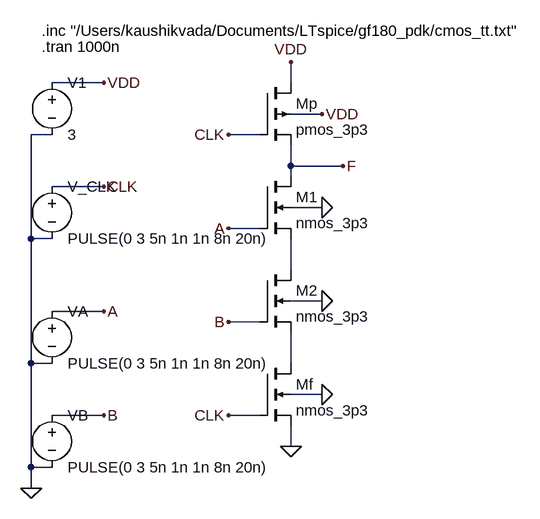
[diagram p0: schematic Q2_9.asc]
Q2_9.asc, the LTspice schematic file:
Version 4
SHEET 1 800 800
WIRE 80 48 160 48
WIRE 80 128 48 128
WIRE 48 128 48 288
WIRE 80 208 160 208
WIRE 80 288 48 288
WIRE 48 288 48 480
WIRE 80 400 160 400
WIRE 80 480 48 480
WIRE 48 480 48 640
WIRE 80 560 160 560
WIRE 80 640 48 640
WIRE 48 640 48 672
WIRE 448 48 448 16
WIRE 448 144 448 176
WIRE 448 176 448 192
WIRE 448 176 528 176
WIRE 448 288 448 336
WIRE 448 432 448 480
WIRE 448 576 448 608
WIRE 352 128 400 128
WIRE 352 272 400 272
WIRE 352 416 400 416
WIRE 352 560 400 560
WIRE 448 96 496 96
WIRE 448 240 496 240
WIRE 448 384 496 384
WIRE 448 528 496 528
FLAG 160 48 VDD
FLAG 48 672 0
FLAG 160 208 CLK
FLAG 160 400 A
FLAG 160 560 B
FLAG 448 16 VDD
FLAG 528 176 F
FLAG 352 128 CLK
FLAG 352 272 A
FLAG 352 416 B
FLAG 352 560 CLK
FLAG 496 96 VDD
FLAG 496 240 0
FLAG 496 384 0
FLAG 496 528 0
FLAG 448 608 0
SYMBOL voltage 80 32 R0
SYMATTR InstName V1
SYMATTR Value 3
SYMBOL voltage 80 192 R0
SYMATTR InstName V_CLK
SYMATTR Value PULSE(0 3 5n 1n 1n 8n 20n)
SYMBOL voltage 80 384 R0
SYMATTR InstName VA
SYMATTR Value PULSE(0 3 5n 1n 1n 8n 20n)
SYMBOL voltage 80 544 R0
SYMATTR InstName VB
SYMATTR Value PULSE(0 3 5n 1n 1n 8n 20n)
SYMBOL pmos4 400 48 R0
SYMATTR InstName Mp
SYMATTR Value pmos_3p3
SYMATTR SpiceLine W=1u L=1u
SYMBOL nmos4 400 192 R0
SYMATTR InstName M1
SYMATTR Value nmos_3p3
SYMATTR SpiceLine W=3u L=1u
SYMBOL nmos4 400 336 R0
SYMATTR InstName M2
SYMATTR Value nmos_3p3
SYMATTR SpiceLine W=3u L=1u
SYMBOL nmos4 400 480 R0
SYMATTR InstName Mf
SYMATTR Value nmos_3p3
SYMATTR SpiceLine W=3u L=1u
TEXT 64 -32 Left 2 !.inc "/Users/kaushikvada/Documents/LTspice/gf180_pdk/cmos_tt.txt"
TEXT 64 -8 Left 2 !.tran 1000n

The netlist it stands for:
* Q2_9.asc
V1 VDD 0 3
V_CLK CLK 0 PULSE(0 3 5n 1n 1n 8n 20n)
VA A 0 PULSE(0 3 5n 1n 1n 8n 20n)
VB B 0 PULSE(0 3 5n 1n 1n 8n 20n)
Mp VDD CLK F VDD pmos_3p3 W=1u L=1u
M1 F A N001 0 nmos_3p3 W=3u L=1u
M2 N001 B N002 0 nmos_3p3 W=3u L=1u
Mf N002 CLK 0 0 nmos_3p3 W=3u L=1u
.model NMOS NMOS
.model PMOS PMOS
.lib standard.mos
.inc "/Users/kaushikvada/Documents/LTspice/gf180_pdk/cmos_tt.txt"
.tran 1000n
.backanno
.end